# Altium project atWork_LCD.PrjPcb
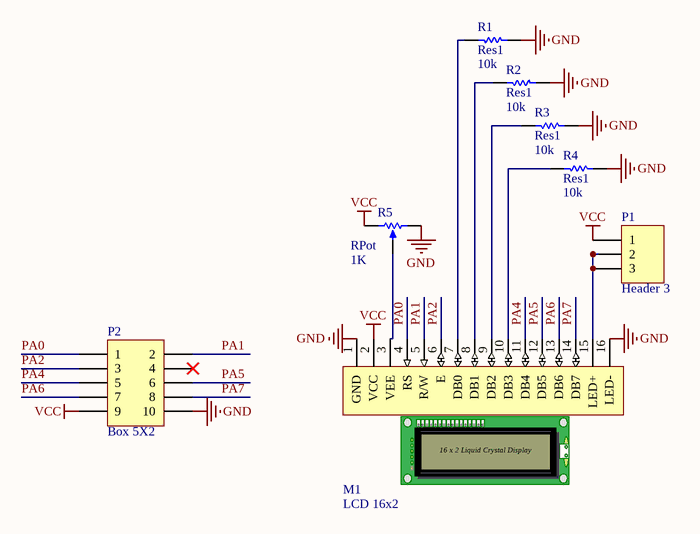
[diagram p0: atWork_LCD.SchDoc]
1 sheet, 8 parts. Net scope: global (net labels, ports and power ports of the same name join across sheets).
Board file: atWork_LCD.PcbDoc

## Sheet atWork_LCD.SchDoc
size A4

### Parts
M1  LCD 16x2  [LCD16PIN]
P1  Header 3  [HDR1X3]
P2  Box 5X2  [BOX2X5_RIGHT]
R1  Res1  value 10k  [C1206]
R2  Res1  value 10k  [C1206]
R3  Res1  value 10k  [C1206]
R4  Res1  value 10k  [C1206]
R5  RPot  value 1K  [RPOT]

### Nets
GND: M1.1(GND) M1.16(LED-) P2.10 R1.2 R2.2 R3.2 R4.2 R5.2(BOT)
VCC: M1.2(VCC) P1.1 P2.9 R5.1(TOP)
PA0: M1.4(RS) P2.1
PA1: M1.5(R/W) P2.2
PA2: M1.6(E) P2.3
PA4: M1.11(DB4) P2.5
PA5: M1.12(DB5) P2.6
PA6: M1.13(DB6) P2.7
PA7: M1.14(DB7) P2.8
NetM1_3: M1.3(VEE) R5.3(TAP)
NetM1_7: M1.7(DB0) R1.1
NetM1_8: M1.8(DB1) R2.1
NetM1_9: M1.9(DB2) R3.1
NetM1_10: M1.10(DB3) R4.1
NetM1_15: M1.15(LED+) P1.2 P1.3

Not connected (* = marked no-connect by the designer): P2 4*

### Notes on the sheet
- (in symbol LCD 16x2) 16 x 2 Liquid Crystal Display

### Library data of the parts
M1 = LCD 16x2: 16-pin 16x2 Liquid Crystal Display; Designer: Meysam Parvizi; Email: meysam.parvizi.ir@gmail.com; Weblog: http://mp.tabin.ir
P1 = Header 3: Header, 3-Pin; LatestRevisionDate: 17-Jul-2002; LatestRevisionNote: Re-released for DXP Platform.; Publisher: Altium Limited
P2 = Box 5X2: Box, 5-Pin, Dual row; Designer: Meysam Parvizi; Email: meysam.parvizi.ir@gmail.com; Weblog: http://mp.tabin.ir
R1-R4 = Res1: Resistor; Published: 8-Jun-2000; LatestRevisionDate: 17-Jul-2002; LatestRevisionNote: Re-released for DXP Platform.; PackageReference: AXIAL-0.3; Publisher: Altium Limited; PackageDescription: Axial Device, Thru-Hole; 2 Leads; 0.3 in Pin Spacing
R5 = RPot: Potentiometer; Designer: Meysam Parvizi; Email: meysam.parvizi.ir@gmail.com; Weblog: http://mp.tabin.ir